# EAGLE schematic board_fertig (EAGLE 8.4.1)
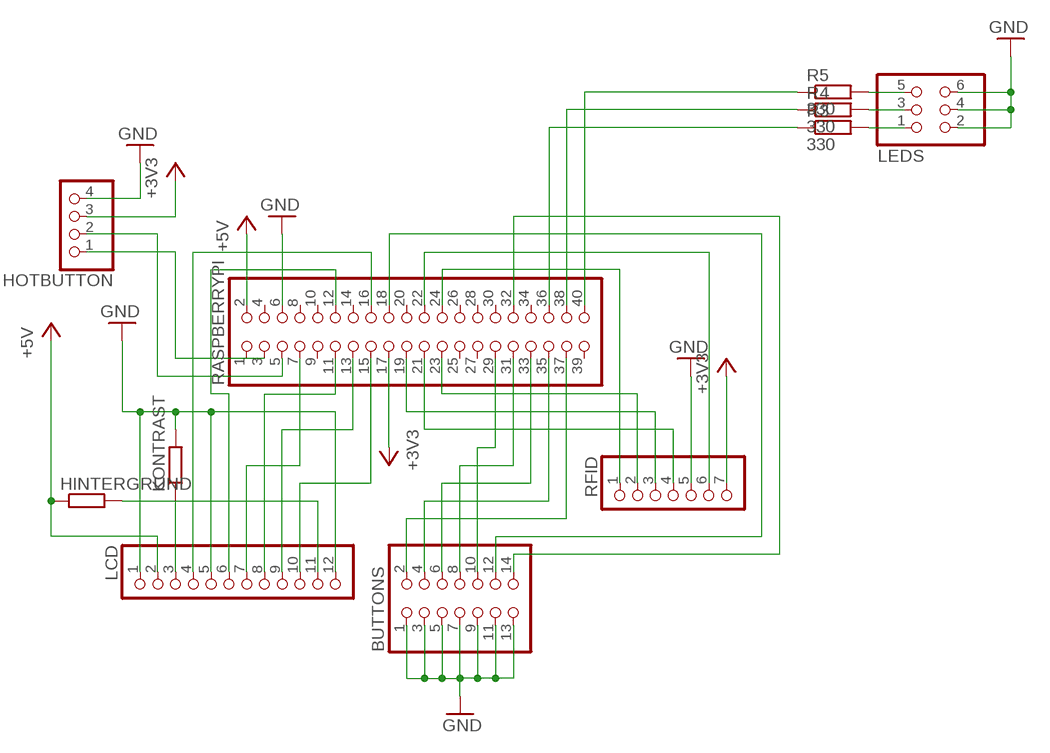
[diagram p0: schematic, sheet 1]

## Parts
BUTTONS  PINHD-2X7  [2X07]
HINTERGRUND  R-EU_0207/10  [0207/10]
HOTBUTTON  PINHD-1X4  [1X04]
KONTRAST  R-EU_0207/10  [0207/10]
LCD  PINHD-1X12  [1X12]
LEDS  PINHD-2X3  [2X03]
R3  330  R-EU_0207/10  [0207/10]
R4  330  R-EU_0207/10  [0207/10]
R5  330  R-EU_0207/10  [0207/10]
RASPBERRYPI  PINHD-2X20  [2X20]
RFID  PINHD-1X7  [1X07]

## Nets
+3V3: HOTBUTTON.3 RASPBERRYPI.17 RFID.7
+5V: HINTERGRUND.1 LCD.2 RASPBERRYPI.2
GND: BUTTONS.1 BUTTONS.3 BUTTONS.5 BUTTONS.7 BUTTONS.9 BUTTONS.11 BUTTONS.13 HOTBUTTON.4 KONTRAST.2 LCD.1 LCD.5 LCD.12 LEDS.2 LEDS.4 LEDS.6 RASPBERRYPI.6 RFID.5
N$1: RASPBERRYPI.22 RFID.6
N$2: RASPBERRYPI.24 RFID.1
N$3: RASPBERRYPI.23 RFID.2
N$4: RASPBERRYPI.19 RFID.3
N$5: RASPBERRYPI.21 RFID.4
N$6: KONTRAST.1 LCD.3
N$7: HINTERGRUND.2 LCD.11
N$8: BUTTONS.2 RASPBERRYPI.37
N$9: BUTTONS.4 RASPBERRYPI.35
N$11: LCD.4 RASPBERRYPI.16
N$12: LCD.6 RASPBERRYPI.12
N$13: LCD.7 RASPBERRYPI.7
N$14: LCD.8 RASPBERRYPI.11
N$15: LCD.9 RASPBERRYPI.13
N$16: LCD.10 RASPBERRYPI.15
N$17: BUTTONS.8 RASPBERRYPI.31
N$18: BUTTONS.10 RASPBERRYPI.29
N$19: BUTTONS.12 RASPBERRYPI.18
N$20: BUTTONS.14 RASPBERRYPI.32
N$21: LEDS.5 R5.2
N$22: LEDS.3 R4.2
N$23: LEDS.1 R3.2
N$24: R5.1 RASPBERRYPI.40
N$25: R4.1 RASPBERRYPI.38
N$26: R3.1 RASPBERRYPI.36
N$27: HOTBUTTON.1 RASPBERRYPI.3
N$28: HOTBUTTON.2 RASPBERRYPI.5
N$29: BUTTONS.6 RASPBERRYPI.33
Unconnected: RASPBERRYPI.1 RASPBERRYPI.4 RASPBERRYPI.8 RASPBERRYPI.9 RASPBERRYPI.10 RASPBERRYPI.14 RASPBERRYPI.20 RASPBERRYPI.25 RASPBERRYPI.26 RASPBERRYPI.27 RASPBERRYPI.28 RASPBERRYPI.30 RASPBERRYPI.34 RASPBERRYPI.39

## Library data of the parts
BUTTONS = pinhead:PINHD-2X7: PIN HEADER
HINTERGRUND KONTRAST R3-R5 = rcl:R-EU_: RESISTOR, European symbol
HOTBUTTON = pinhead:PINHD-1X4: PIN HEADER
LCD = pinhead:PINHD-1X12: PIN HEADER
LEDS = pinhead:PINHD-2X3: PIN HEADER
RASPBERRYPI = pinhead:PINHD-2X20: PIN HEADER
RFID = pinhead:PINHD-1X7: PIN HEADER